# Altium schematic sheet [06] - USB HIGHSPEED PHY.SchDoc
size A4; SheetNumber: 7; SheetTotal: 10
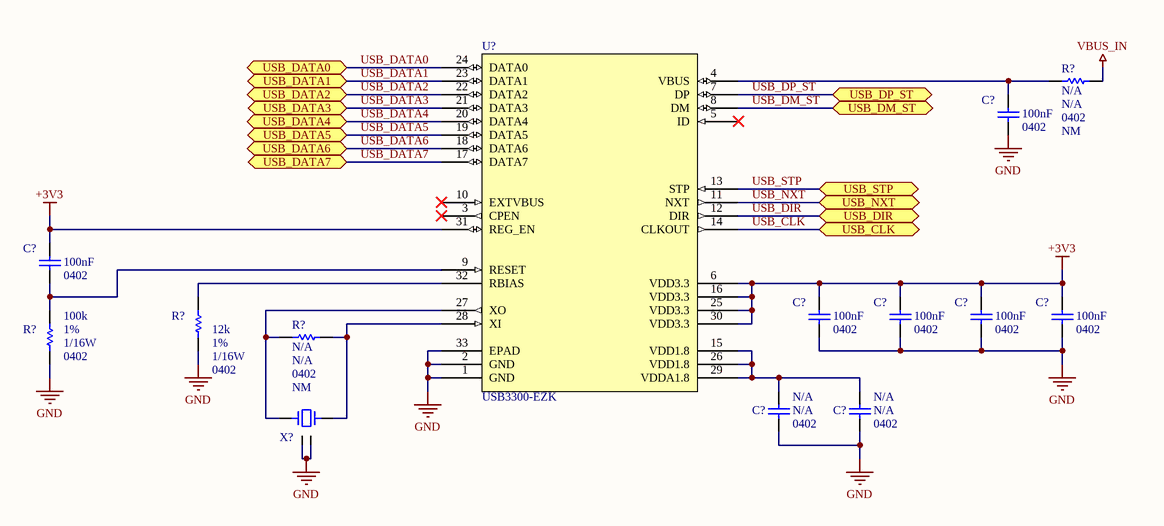
[diagram p0: [06] - USB HIGHSPEED PHY.SchDoc]

## Parts
(Parts that share a designator on the sheet are numbered #1, #2 ... from top to bottom, then left to right.)
C?#1  Package / Case: 0402  Capacitance: 100nF  [CAP_0402]  (hidden comment: CAP 0402)
C?#2  Package / Case: 0402  Capacitance: 100nF  [CAP_0402]  (hidden comment: CAP 0402)
C?#3  Package / Case: 0402  Capacitance: 100nF  [CAP_0402]  (hidden comment: CAP 0402)
C?#4  Package / Case: 0402  Capacitance: 100nF  [CAP_0402]  (hidden comment: CAP 0402)
C?#5  Package / Case: 0402  Capacitance: 100nF  [CAP_0402]  (hidden comment: CAP 0402)
C?#6  Package / Case: 0402  Capacitance: 100nF  [CAP_0402]  (hidden comment: CAP 0402)
C?#7  Package / Case: 0402  [CAP_0402]  (hidden comment: CAP 0402)
C?#8  Package / Case: 0402  [CAP_0402]  (hidden comment: CAP 0402)
R?#1  Package / Case: 0402  Resistance: NM  [RES_0402]  (hidden comment: RES 0402)
R?#2  Tolerance: 1%  Rated Power: 1/16W  Package / Case: 0402  Resistance: 12k  [RES_0402]  (hidden comment: RES 0402)
R?#3  Package / Case: 0402  Resistance: NM  [RES_0402]  (hidden comment: RES 0402)
R?#4  Tolerance: 1%  Rated Power: 1/16W  Package / Case: 0402  Resistance: 100k  [RES_0402]  (hidden comment: RES 0402)
U?  USB3300-EZK  [PKG_QFN-32-5X5]
X?  XTAL_2016  [XTAL_2016]  (value not drawn)

## Ports
USB_CLK (bidir), USB_DATA0 (bidir), USB_DATA1 (bidir), USB_DATA2 (bidir), USB_DATA3 (bidir), USB_DATA4 (bidir), USB_DATA5 (bidir), USB_DATA6 (bidir), USB_DATA7 (bidir), USB_DIR (bidir), USB_DM_ST (bidir), USB_DP_ST (bidir), USB_NXT (bidir), USB_STP (bidir)

## Nets
+3V3: C?#2.2 C?#3.2 C?#4.2 C?#5.2 C?#6.2 U?.6(VDD3.3) U?.16(VDD3.3) U?.25(VDD3.3) U?.30(VDD3.3) U?.31(REG_EN)
GND: C?#1.1 C?#3.1 C?#4.1 C?#5.1 C?#6.1 C?#7.1 C?#8.1 R?#2.2 R?#4.1 U?.1(GND) U?.2(GND) U?.33(EPAD) X?.2 X?.4
VBUS_IN: R?#1.1
USB_CLK: U?.14(CLKOUT) ; port USB_CLK
USB_DATA0: U?.24(DATA0) ; port USB_DATA0
USB_DATA1: U?.23(DATA1) ; port USB_DATA1
USB_DATA2: U?.22(DATA2) ; port USB_DATA2
USB_DATA3: U?.21(DATA3) ; port USB_DATA3
USB_DATA4: U?.20(DATA4) ; port USB_DATA4
USB_DATA5: U?.19(DATA5) ; port USB_DATA5
USB_DATA6: U?.18(DATA6) ; port USB_DATA6
USB_DATA7: U?.17(DATA7) ; port USB_DATA7
USB_DIR: U?.12(DIR) ; port USB_DIR
USB_DM_ST: U?.8(DM) ; port USB_DM_ST
USB_DP_ST: U?.7(DP) ; port USB_DP_ST
USB_NXT: U?.11(NXT) ; port USB_NXT
USB_STP: U?.13(STP) ; port USB_STP
NetC?#1_2: C?#1.2 R?#1.2 U?.4(VBUS)
NetC?#2_1: C?#2.1 R?#4.2 U?.9(RESET)
NetC?#7_2: C?#7.2 C?#8.2 U?.15(VDD1.8) U?.26(VDD1.8) U?.29(VDDA1.8)
NetR?#2_1: R?#2.1 U?.32(RBIAS)
NetR?#3_1: R?#3.1 U?.28(XI) X?.3
NetR?#3_2: R?#3.2 U?.27(XO) X?.1

Not connected (* = marked no-connect by the designer): U? 3(CPEN)* 5(ID)* 10(EXTVBUS)*

## Library data of the parts
C?#1-C?#6 = CAP_0402_NM: CAP, size 0402, NM, N/A; Tolerance: 10%; Voltage Rating DC: 50V; Supplier URL: https://www.thegioiic.com/tu-gom-0402-100nf-0-1uf-50v; Supplier: thegioiic; Supplier Part Number: Tụ Gốm 0402 100nF (0.1uF) 50V; ComponentLink1Description: Datasheet; ComponentLink1URL: N/A; Mount: SMD/SMT; Operating Temperature Max: + 85 C; Operating Temperature Min: - 40 C; Packaging: Tape and Reel
C?#7 C?#8 = CAP_0402_NM: CAP, size 0402, NM, N/A; Supplier URL: N/A; Tolerance: N/A; Supplier: N/A; Supplier Part Number: N/A; ComponentLink1Description: Datasheet; ComponentLink1URL: N/A; Mount: SMD/SMT; Operating Temperature Max: + 85 C; Operating Temperature Min: - 40 C; Packaging: Tape and Reel; Voltage Rating DC: N/A; Capacitance: N/A
R?#1 R?#3 = RES_0402_NM: RES, size 0402, NM, N/A; Supplier backup URL: N/A; Packaging: Tape and Reel; Supplier: N/A; Supplier Part Number: N/A; Supplier backup: N/A; Supplier backup Part Number: N/A; Manufacturer: N/A; Manufacturer Part Number: N/A; ComponentLink1Description: Datasheet; ComponentLink1URL: N/A; Mount: SMD/SMT; Operating Temperature Max: + 85 C; Operating Temperature Min: - 40 C; LCSC Part #: N/A; Supplier URL: N/A; Tolerance: N/A; Rated Power: N/A
R?#2 R?#4 = RES_0402_NM: RES, size 0402, NM, N/A; Manufacturer: OEM; Supplier backup URL: N/A; Packaging: Tape and Reel; Supplier backup: N/A; Supplier backup Part Number: N/A; Manufacturer Part Number: N/A; ComponentLink1Description: Datasheet; ComponentLink1URL: N/A; Mount: SMD/SMT; Operating Temperature Max: + 85 C; Operating Temperature Min: - 40 C
  R?#2: Supplier: CXT; Supplier Part Number: C020903; Supplier URL: https://linhkien.cxtvn.com/4697-dien-tro-0402-1-thong-so-tu-1k-den-91k.html
  R?#4: Supplier: thegioiic; Supplier Part Number: Điện Trở 100 KOhm 0402 1%; Supplier URL: https://www.thegioiic.com/dien-tro-100-kohm-0402-1-
U? = IC_USB3300-EZK: Description; Manufacturer_Name: Microchip; Copyright: Copyright (C) 2025 Ultra Librarian. All rights reserved.; Manufacturer_Part_Number: USB3300-EZK; RefDes: RefDes; Type: Type
X? = XTAL_SMD_4PIN: Crystal SMD 4-Pin 2.0x1.6mm; Distributor Link: *